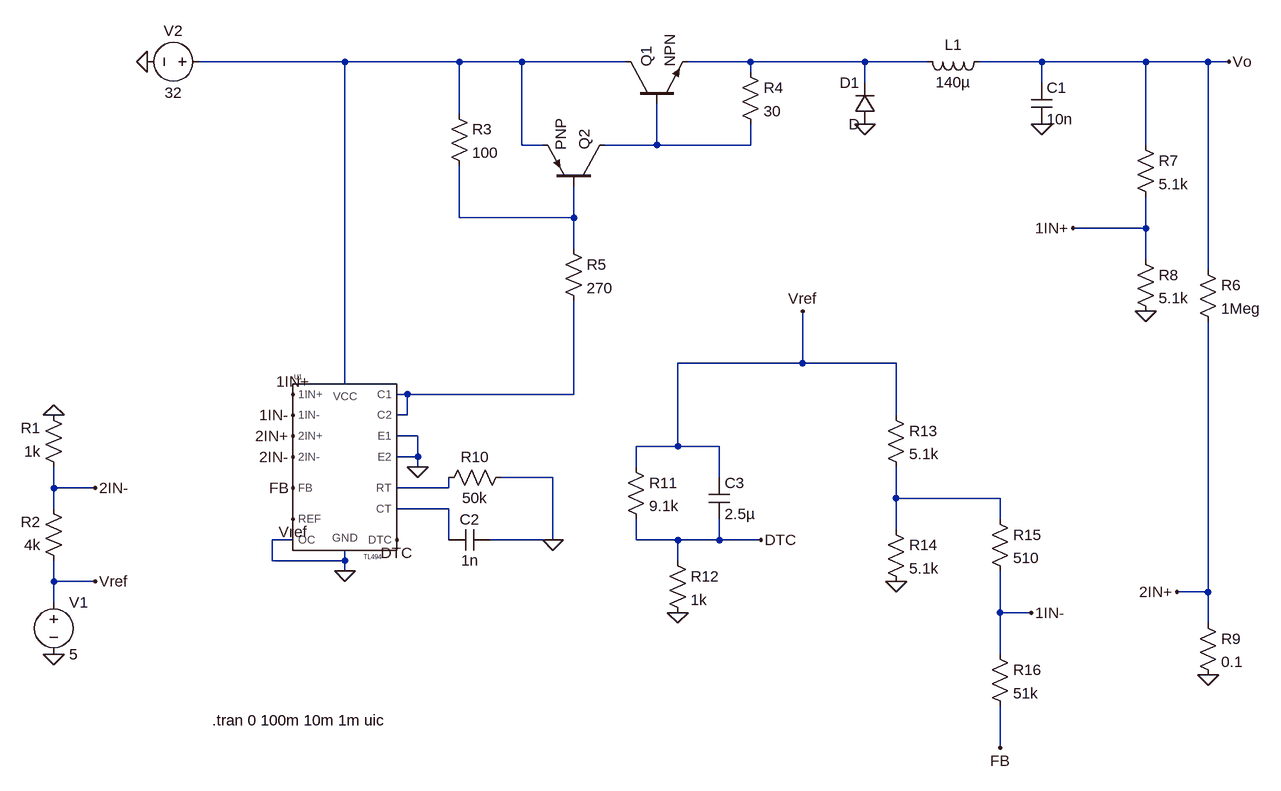
[diagram p0: schematic app_note.asc]
app_note.asc, the LTspice schematic file:
Version 4
SHEET 1 1624 688
WIRE 208 -464 -16 -464
WIRE 384 -464 208 -464
WIRE 480 -464 384 -464
WIRE 640 -464 480 -464
WIRE 832 -464 736 -464
WIRE 1008 -464 832 -464
WIRE 1104 -464 1008 -464
WIRE 1280 -464 1184 -464
WIRE 1440 -464 1280 -464
WIRE 1536 -464 1440 -464
WIRE 1568 -464 1536 -464
WIRE 832 -448 832 -464
WIRE 1008 -432 1008 -464
WIRE 1280 -432 1280 -464
WIRE 384 -384 384 -464
WIRE 480 -336 480 -464
WIRE 512 -336 480 -336
WIRE 688 -336 688 -400
WIRE 688 -336 608 -336
WIRE 832 -336 832 -368
WIRE 832 -336 688 -336
WIRE 1440 -336 1440 -464
WIRE 384 -224 384 -304
WIRE 560 -224 560 -272
WIRE 560 -224 384 -224
WIRE 1440 -208 1440 -256
WIRE 1440 -208 1328 -208
WIRE 560 -176 560 -224
WIRE 1440 -160 1440 -208
WIRE 1536 -144 1536 -464
WIRE 912 0 912 -80
WIRE 912 0 720 0
WIRE 1056 0 912 0
WIRE 208 32 208 -464
WIRE 304 48 288 48
WIRE 560 48 560 -96
WIRE 560 48 304 48
WIRE 304 80 304 48
WIRE 304 80 288 80
WIRE 1056 80 1056 0
WIRE 320 112 288 112
WIRE 720 128 720 0
WIRE 720 128 656 128
WIRE 784 128 720 128
WIRE 320 144 320 112
WIRE 320 144 288 144
WIRE 320 160 320 144
WIRE 656 160 656 128
WIRE 528 176 448 176
WIRE 784 176 784 128
WIRE -240 192 -240 160
WIRE -176 192 -240 192
WIRE 368 192 368 176
WIRE 368 192 288 192
WIRE 1056 208 1056 160
WIRE 1216 208 1056 208
WIRE -240 224 -240 192
WIRE 368 224 288 224
WIRE 1216 240 1216 208
WIRE 1056 256 1056 208
WIRE 128 272 96 272
WIRE 368 272 368 224
WIRE 528 272 528 176
WIRE 528 272 432 272
WIRE 656 272 656 240
WIRE 720 272 656 272
WIRE 784 272 784 240
WIRE 784 272 720 272
WIRE 848 272 784 272
WIRE 96 304 96 272
WIRE 208 304 208 288
WIRE 208 304 96 304
WIRE 720 304 720 272
WIRE 208 320 208 304
WIRE -240 336 -240 304
WIRE -176 336 -240 336
WIRE 1536 352 1536 -64
WIRE 1536 352 1488 352
WIRE -240 368 -240 336
WIRE 1216 384 1216 320
WIRE 1264 384 1216 384
WIRE 1536 400 1536 352
WIRE 1216 448 1216 384
WIRE 1216 592 1216 528
FLAG -240 448 0
FLAG 208 320 0
FLAG -240 80 0
FLAG -176 336 Vref
FLAG 128 240 Vref
FLAG -176 192 2IN-
FLAG 128 144 2IN-
FLAG -96 -464 0
FLAG 320 160 0
FLAG 1008 -368 0
FLAG 1280 -368 0
FLAG 1536 480 0
FLAG 1440 -80 0
FLAG 128 48 1IN+
FLAG 1328 -208 1IN+
FLAG 1488 352 2IN+
FLAG 128 112 2IN+
FLAG 1568 -464 Vo
FLAG 528 272 0
FLAG 720 384 0
FLAG 912 -80 Vref
FLAG 848 272 DTC
FLAG 288 272 DTC
FLAG 1056 336 0
FLAG 1264 384 1IN-
FLAG 128 80 1IN-
FLAG 128 192 FB
FLAG 1216 592 FB
SYMBOL TL494 208 160 R0
SYMATTR InstName U1
SYMBOL res -224 176 R180
WINDOW 0 36 76 Left 2
WINDOW 3 36 40 Left 2
SYMATTR InstName R1
SYMATTR Value 1k
SYMBOL res -224 320 R180
WINDOW 0 36 76 Left 2
WINDOW 3 36 40 Left 2
SYMATTR InstName R2
SYMATTR Value 4k
SYMBOL voltage -240 352 R0
WINDOW 123 0 0 Left 0
WINDOW 39 0 0 Left 0
SYMATTR InstName V1
SYMATTR Value 5
SYMBOL voltage 0 -464 R90
WINDOW 0 -32 56 VBottom 2
WINDOW 3 32 56 VTop 2
WINDOW 123 0 0 Left 0
WINDOW 39 0 0 Left 0
SYMATTR InstName V2
SYMATTR Value 32
SYMBOL npn 640 -400 R270
SYMATTR InstName Q1
SYMBOL pnp 608 -272 M270
SYMATTR InstName Q2
SYMBOL res 368 -400 R0
SYMATTR InstName R3
SYMATTR Value 100
SYMBOL res 816 -464 R0
SYMATTR InstName R4
SYMATTR Value 30
SYMBOL res 544 -192 R0
SYMATTR InstName R5
SYMATTR Value 270
SYMBOL diode 1024 -368 R180
WINDOW 0 24 64 Left 2
WINDOW 3 24 0 Left 2
SYMATTR InstName D1
SYMBOL ind 1200 -480 R90
WINDOW 0 5 56 VBottom 2
WINDOW 3 32 56 VTop 2
SYMATTR InstName L1
SYMATTR Value 140µ
SYMBOL cap 1264 -432 R0
SYMATTR InstName C1
SYMATTR Value 10n
SYMBOL res 1520 -160 R0
SYMATTR InstName R6
SYMATTR Value 1Meg
SYMBOL res 1424 -352 R0
SYMATTR InstName R7
SYMATTR Value 5.1k
SYMBOL res 1424 -176 R0
SYMATTR InstName R8
SYMATTR Value 5.1k
SYMBOL res 1520 384 R0
SYMATTR InstName R9
SYMATTR Value 0.1
SYMBOL res 464 160 R90
WINDOW 0 0 56 VBottom 2
WINDOW 3 32 56 VTop 2
SYMATTR InstName R10
SYMATTR Value 50k
SYMBOL cap 432 256 R90
WINDOW 0 0 32 VBottom 2
WINDOW 3 32 32 VTop 2
SYMATTR InstName C2
SYMATTR Value 1n
SYMBOL res 640 144 R0
SYMATTR InstName R11
SYMATTR Value 9.1k
SYMBOL cap 768 176 R0
SYMATTR InstName C3
SYMATTR Value 2.5µ
SYMBOL res 704 288 R0
SYMATTR InstName R12
SYMATTR Value 1k
SYMBOL res 1040 64 R0
SYMATTR InstName R13
SYMATTR Value 5.1k
SYMBOL res 1040 240 R0
SYMATTR InstName R14
SYMATTR Value 5.1k
SYMBOL res 1200 224 R0
SYMATTR InstName R15
SYMATTR Value 510
SYMBOL res 1200 432 R0
SYMATTR InstName R16
SYMATTR Value 51k
TEXT 4 550 Left 2 !.tran 0 100m 10m 1m uic

The netlist it stands for:
* app_note.asc
XU1 1IN+ 1IN- FB DTC N008 N006 0 N005 0 0 N005 N001 0 Vref 2IN- 2IN+ TL494  ; pins 1IN+ 1IN- FB DTC CT RT GND C1 E1 E2 C2 VCC OC REF 2IN- 2IN+
R1 2IN- 0 1k
R2 Vref 2IN- 4k
V1 Vref 0 5
V2 N001 0 32
Q1 N001 N003 N002 0 NPN
Q2 N003 N004 N001 0 PNP
R3 N001 N004 100
R4 N002 N003 30
R5 N004 N005 270
D1 0 N002 D
L1 Vo N002 140µ
C1 Vo 0 10n
R6 Vo 2IN+ 1Meg
R7 Vo 1IN+ 5.1k
R8 1IN+ 0 5.1k
R9 2IN+ 0 0.1
R10 0 N006 50k
C2 0 N008 1n
R11 Vref DTC 9.1k
C3 Vref DTC 2.5µ
R12 DTC 0 1k
R13 Vref N007 5.1k
R14 N007 0 5.1k
R15 N007 1IN- 510
R16 1IN- FB 51k
.model D D
.lib standard.dio
.model NPN NPN
.model PNP PNP
.lib standard.bjt
.tran 0 100m 10m 1m uic
.lib eigene/TL494.sub
.backanno
.end